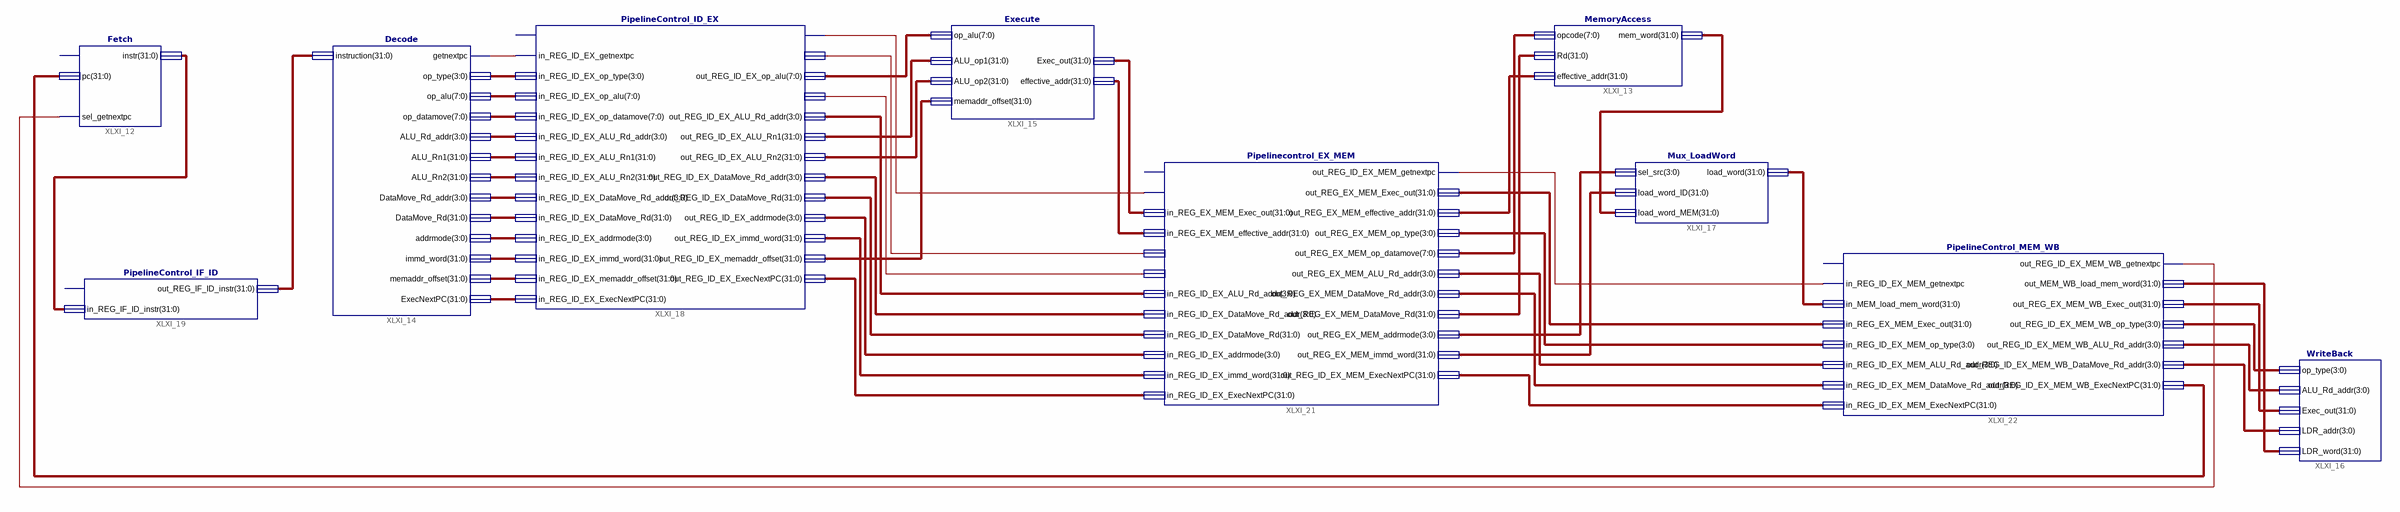
[diagram p0: schematic sheet 1]
// Xilinx ISE schematic CpuSchematic.sch (spartan3a) as structural Verilog: 10 symbols, 0 ports
module CpuSchematic (
);

  wire XLXN_231, XLXN_422, XLXN_584, XLXN_602;
  wire [3:0] XLXN_232, XLXN_235, XLXN_238, XLXN_240, XLXN_436, XLXN_437, XLXN_439, XLXN_447, XLXN_586,
       XLXN_590, XLXN_591, XLXN_594, XLXN_595, XLXN_596;
  wire [7:0] XLXN_233, XLXN_234, XLXN_419, XLXN_444;
  wire [31:0] XLXN_218, XLXN_236, XLXN_237, XLXN_239, XLXN_241, XLXN_242, XLXN_243, XLXN_421, XLXN_423,
       XLXN_424, XLXN_425, XLXN_428, XLXN_438, XLXN_440, XLXN_441, XLXN_443, XLXN_445, XLXN_446, XLXN_448,
       XLXN_582, XLXN_585, XLXN_587, XLXN_589, XLXN_592, XLXN_593, XLXN_603;

  Fetch XLXI_12 (.pc(XLXN_603), .instr(XLXN_218), .sel_getnextpc(XLXN_602));  // open: clock
  PipelineControl_IF_ID XLXI_19 (.in_REG_IF_ID_instr(XLXN_218), .out_REG_IF_ID_instr(XLXN_582));  // open: clock
  Decode XLXI_14 (
    .instruction(XLXN_582), .getnextpc(XLXN_231), .ExecNextPC(XLXN_243), .op_type(XLXN_232),
    .op_alu(XLXN_233), .op_datamove(XLXN_234), .ALU_Rd_addr(XLXN_235), .ALU_Rn1(XLXN_236),
    .ALU_Rn2(XLXN_237), .DataMove_Rd_addr(XLXN_238), .DataMove_Rd(XLXN_239), .addrmode(XLXN_240),
    .immd_word(XLXN_241), .memaddr_offset(XLXN_242));
  PipelineControl_ID_EX XLXI_18 (
    .in_REG_ID_EX_getnextpc(XLXN_231), .in_REG_ID_EX_ExecNextPC(XLXN_243), .in_REG_ID_EX_op_type(XLXN_232),
    .in_REG_ID_EX_op_alu(XLXN_233), .in_REG_ID_EX_op_datamove(XLXN_234), .in_REG_ID_EX_ALU_Rd_addr(XLXN_235),
    .in_REG_ID_EX_ALU_Rn1(XLXN_236), .in_REG_ID_EX_ALU_Rn2(XLXN_237),
    .in_REG_ID_EX_DataMove_Rd_addr(XLXN_238), .in_REG_ID_EX_DataMove_Rd(XLXN_239),
    .in_REG_ID_EX_addrmode(XLXN_240), .in_REG_ID_EX_immd_word(XLXN_241),
    .in_REG_ID_EX_memaddr_offset(XLXN_242), .out_REG_ID_EX_getnextpc(XLXN_422),
    .out_REG_ID_EX_ExecNextPC(XLXN_441), .out_REG_ID_EX_op_type({4{XLXN_422}}),
    .out_REG_ID_EX_op_alu(XLXN_419), .out_REG_ID_EX_op_datamove({8{XLXN_422}}),
    .out_REG_ID_EX_ALU_Rd_addr(XLXN_436), .out_REG_ID_EX_ALU_Rn1(XLXN_423), .out_REG_ID_EX_ALU_Rn2(XLXN_424),
    .out_REG_ID_EX_DataMove_Rd_addr(XLXN_437), .out_REG_ID_EX_DataMove_Rd(XLXN_438),
    .out_REG_ID_EX_addrmode(XLXN_439), .out_REG_ID_EX_immd_word(XLXN_440),
    .out_REG_ID_EX_memaddr_offset(XLXN_425));  // open: clock
  Execute XLXI_15 (
    .op_alu(XLXN_419), .ALU_op1(XLXN_423), .ALU_op2(XLXN_424), .memaddr_offset(XLXN_425),
    .Exec_out(XLXN_421), .effective_addr(XLXN_428));
  Pipelinecontrol_EX_MEM XLXI_21 (
    .in_REG_ID_EX_getnextpc(XLXN_422), .in_REG_ID_EX_ExecNextPC(XLXN_441), .in_REG_EX_MEM_Exec_out(XLXN_421),
    .in_REG_EX_MEM_effective_addr(XLXN_428), .in_REG_ID_EX_op_type({4{XLXN_422}}),
    .in_REG_ID_EX_op_datamove({8{XLXN_422}}), .in_REG_ID_EX_ALU_Rd_addr(XLXN_436),
    .in_REG_ID_EX_DataMove_Rd_addr(XLXN_437), .in_REG_ID_EX_DataMove_Rd(XLXN_438),
    .in_REG_ID_EX_addrmode(XLXN_439), .in_REG_ID_EX_immd_word(XLXN_440),
    .out_REG_ID_EX_MEM_getnextpc(XLXN_584), .out_REG_ID_EX_MEM_ExecNextPC(XLXN_587),
    .out_REG_EX_MEM_Exec_out(XLXN_585), .out_REG_EX_MEM_effective_addr(XLXN_443),
    .out_REG_EX_MEM_op_type(XLXN_586), .out_REG_EX_MEM_op_datamove(XLXN_444),
    .out_REG_EX_MEM_ALU_Rd_addr(XLXN_590), .out_REG_EX_MEM_DataMove_Rd_addr(XLXN_591),
    .out_REG_EX_MEM_DataMove_Rd(XLXN_445), .out_REG_EX_MEM_addrmode(XLXN_447),
    .out_REG_EX_MEM_immd_word(XLXN_448));  // open: clock
  MemoryAccess XLXI_13 (.opcode(XLXN_444), .Rd(XLXN_445), .effective_addr(XLXN_443), .mem_word(XLXN_446));
  Mux_LoadWord XLXI_17 (.sel_src(XLXN_447), .load_word_ID(XLXN_448), .load_word_MEM(XLXN_446), .load_word(XLXN_589));
  WriteBack XLXI_16 (
    .op_type(XLXN_594), .ALU_Rd_addr(XLXN_595), .Exec_out(XLXN_592), .LDR_addr(XLXN_596), .LDR_word(XLXN_593));
  PipelineControl_MEM_WB XLXI_22 (
    .in_REG_ID_EX_MEM_getnextpc(XLXN_584), .in_REG_ID_EX_MEM_ExecNextPC(XLXN_587),
    .in_MEM_load_mem_word(XLXN_589), .in_REG_EX_MEM_Exec_out(XLXN_585), .in_REG_ID_EX_MEM_op_type(XLXN_586),
    .in_REG_ID_EX_MEM_ALU_Rd_addr(XLXN_590), .in_REG_ID_EX_MEM_DataMove_Rd_addr(XLXN_591),
    .out_REG_ID_EX_MEM_WB_getnextpc(XLXN_602), .out_REG_ID_EX_MEM_WB_ExecNextPC(XLXN_603),
    .out_MEM_WB_load_mem_word(XLXN_593), .out_REG_EX_MEM_WB_Exec_out(XLXN_592),
    .out_REG_ID_EX_MEM_WB_op_type(XLXN_594), .out_REG_ID_EX_MEM_WB_ALU_Rd_addr(XLXN_595),
    .out_REG_ID_EX_MEM_WB_DataMove_Rd_addr(XLXN_596));  // open: clock
endmodule
